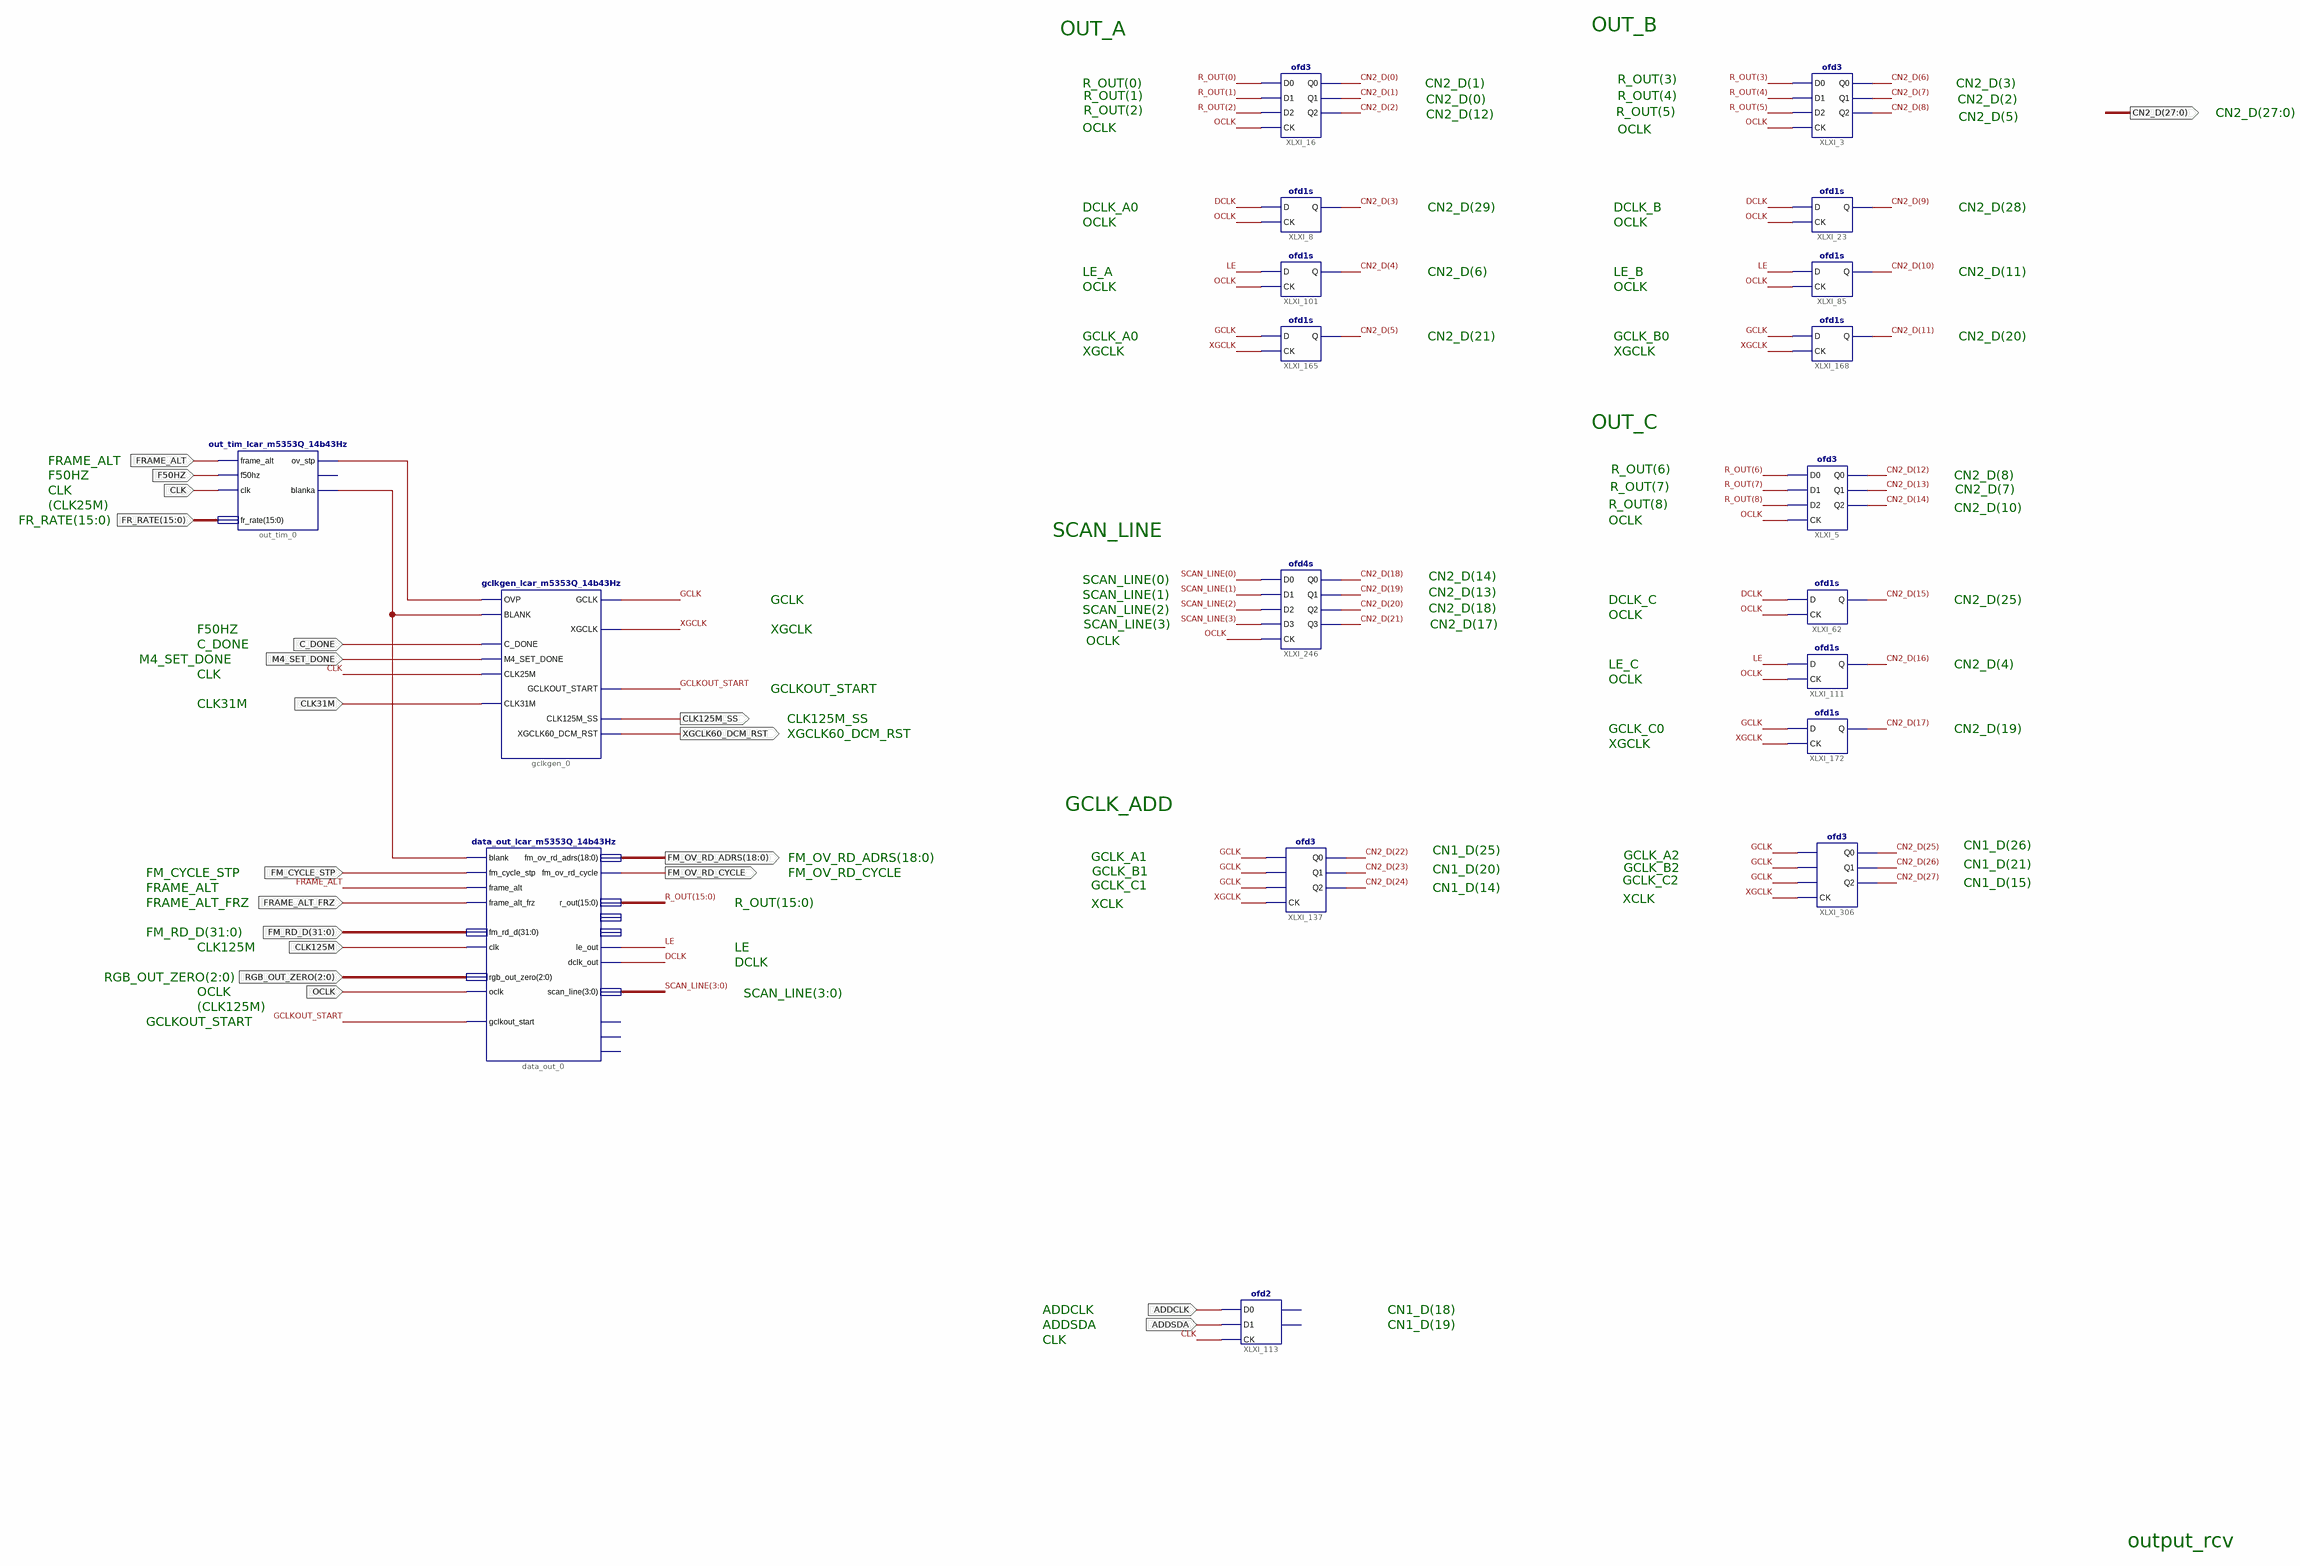
[diagram p0: schematic sheet 1]
// Xilinx ISE schematic output_rcv_lcar_m5353Q_14b43Hz.sch (aspartan6) as structural Verilog: 19 symbols, 20 ports
module output_rcv_lcar_m5353Q_14b43Hz (
  input  CLK,
  input  ADDCLK,
  input  ADDSDA,
  input  FRAME_ALT,
  input  F50HZ,
  input  C_DONE,
  input  M4_SET_DONE,
  input  CLK125M,
  input  FM_CYCLE_STP,
  input  [31:0] FM_RD_D,
  input  [2:0] RGB_OUT_ZERO,
  input  OCLK,
  input  [15:0] FR_RATE,
  input  FRAME_ALT_FRZ,
  input  CLK31M,
  output [27:0] CN2_D,
  output [18:0] FM_OV_RD_ADRS,
  output FM_OV_RD_CYCLE,
  output CLK125M_SS,
  output XGCLK60_DCM_RST
);

  wire DCLK, GCLK, GCLKOUT_START, LE, XGCLK, XLXN_6, XLXN_10;
  wire [3:0] SCAN_LINE;
  wire [15:0] R_OUT;

  ofd2 XLXI_113 (.D0(ADDCLK), .D1(ADDSDA), .CK(CLK));  // open: Q0, Q1
  ofd4s XLXI_246 (
    .D0(SCAN_LINE[0]), .CK(OCLK), .D1(SCAN_LINE[1]), .D2(SCAN_LINE[2]), .D3(SCAN_LINE[3]), .Q0(CN2_D[18]),
    .Q1(CN2_D[19]), .Q2(CN2_D[20]), .Q3(CN2_D[21]));
  ofd3 XLXI_5 (.D0(R_OUT[6]), .D1(R_OUT[7]), .D2(R_OUT[8]), .CK(OCLK), .Q0(CN2_D[12]), .Q1(CN2_D[13]), .Q2(CN2_D[14]));
  ofd1s XLXI_62 (.D(DCLK), .CK(OCLK), .Q(CN2_D[15]));
  ofd1s XLXI_111 (.D(LE), .CK(OCLK), .Q(CN2_D[16]));
  ofd1s XLXI_172 (.D(GCLK), .CK(XGCLK), .Q(CN2_D[17]));
  ofd1s XLXI_85 (.D(LE), .CK(OCLK), .Q(CN2_D[10]));
  ofd1s XLXI_168 (.D(GCLK), .CK(XGCLK), .Q(CN2_D[11]));
  ofd1s XLXI_23 (.D(DCLK), .CK(OCLK), .Q(CN2_D[9]));
  ofd3 XLXI_3 (.D0(R_OUT[3]), .D1(R_OUT[4]), .D2(R_OUT[5]), .CK(OCLK), .Q0(CN2_D[6]), .Q1(CN2_D[7]), .Q2(CN2_D[8]));
  ofd3 XLXI_16 (.D0(R_OUT[0]), .D1(R_OUT[1]), .D2(R_OUT[2]), .CK(OCLK), .Q0(CN2_D[0]), .Q1(CN2_D[1]), .Q2(CN2_D[2]));
  ofd1s XLXI_101 (.D(LE), .CK(OCLK), .Q(CN2_D[4]));
  ofd1s XLXI_165 (.D(GCLK), .CK(XGCLK), .Q(CN2_D[5]));
  ofd1s XLXI_8 (.D(DCLK), .CK(OCLK), .Q(CN2_D[3]));
  ofd3 XLXI_137 (.D0(GCLK), .D1(GCLK), .D2(GCLK), .CK(XGCLK), .Q0(CN2_D[22]), .Q1(CN2_D[23]), .Q2(CN2_D[24]));
  ofd3 XLXI_306 (.D0(GCLK), .D1(GCLK), .D2(GCLK), .CK(XGCLK), .Q0(CN2_D[25]), .Q1(CN2_D[26]), .Q2(CN2_D[27]));
  data_out_lcar_m5353Q_14b43Hz data_out_0 (
    .fm_cycle_stp(FM_CYCLE_STP), .frame_alt_frz(FRAME_ALT_FRZ), .frame_alt(FRAME_ALT), .clk(CLK125M),
    .oclk(OCLK), .blank(XLXN_10), .gclkout_start(GCLKOUT_START), .fm_rd_d(FM_RD_D),
    .rgb_out_zero(RGB_OUT_ZERO), .fm_ov_rd_cycle(FM_OV_RD_CYCLE), .le_out(LE), .dclk_out(DCLK),
    .fm_ov_rd_adrs(FM_OV_RD_ADRS), .scan_line(SCAN_LINE), .r_out(R_OUT));  // open: r_we, g_we, b_we, g_out, b_out
  out_tim_lcar_m5353Q_14b43Hz out_tim_0 (
    .clk(CLK), .f50hz(F50HZ), .frame_alt(FRAME_ALT), .fr_rate(FR_RATE), .blanka(XLXN_10), .ov_stp(XLXN_6));  // open: ovt
  gclkgen_lcar_m5353Q_14b43Hz gclkgen_0 (
    .C_DONE(C_DONE), .OVP(XLXN_6), .CLK25M(CLK), .CLK31M(CLK31M), .BLANK(XLXN_10), .M4_SET_DONE(M4_SET_DONE),
    .XGCLK60_DCM_RST(XGCLK60_DCM_RST), .XGCLK(XGCLK), .GCLK(GCLK), .GCLKOUT_START(GCLKOUT_START),
    .CLK125M_SS(CLK125M_SS));

  // Notes on the sheet:
  //   OUT_B
  //   OUT_A
  //   R_OUT(3)
  //   R_OUT(0)
  //   CN2_D(1)
  //   CN2_D(3)
  //   R_OUT(1)
  //   R_OUT(4)
  //   CN2_D(0)
  //   CN2_D(2)
  //   R_OUT(2)
  //   R_OUT(5)
  //   CN2_D(27:0)
  //   CN2_D(12)
  //   CN2_D(5)
  //   OCLK
  //   OCLK
  //   DCLK_A0
  //   CN2_D(29)
  //   DCLK_B
  //   CN2_D(28)
  //   OCLK
  //   OCLK
  //   LE_A
  //   CN2_D(6)
  //   LE_B
  //   CN2_D(11)
  //   OCLK
  //   OCLK
  //   GCLK_A0
  //   CN2_D(21)
  //   GCLK_B0
  //   CN2_D(20)
  //   XGCLK
  //   XGCLK
  //   OUT_C
  //   FRAME_ALT
  //   R_OUT(6)
  //   F50HZ
  //   CN2_D(8)
  //   R_OUT(7)
  //   CN2_D(7)
  //   CLK
  //   R_OUT(8)
  //   (CLK25M)
  //   CN2_D(10)
  //   FR_RATE(15:0)
  //   OCLK
  //   SCAN_LINE
  //   CN2_D(14)
  //   SCAN_LINE(0)
  //   CN2_D(13)
  //   SCAN_LINE(1)
  //   GCLK
  //   DCLK_C
  //   CN2_D(25)
  //   CN2_D(18)
  //   SCAN_LINE(2)
  //   OCLK
  //   SCAN_LINE(3)
  //   CN2_D(17)
  //   F50HZ
  //   XGCLK
  //   OCLK
  //   C_DONE
  //   M4_SET_DONE
  //   LE_C
  //   CN2_D(4)
  //   CLK
  //   OCLK
  //   GCLKOUT_START
  //   CLK31M
  //   CLK125M_SS
  //   GCLK_C0
  //   CN2_D(19)
  //   XGCLK60_DCM_RST
  //   XGCLK
  //   GCLK_ADD
  //   CN1_D(26)
  //   CN1_D(25)
  //   GCLK_A2
  //   GCLK_A1
  //   FM_OV_RD_ADRS(18:0)
  //   CN1_D(21)
  //   GCLK_B2
  //   CN1_D(20)
  //   GCLK_B1
  //   FM_CYCLE_STP
  //   FM_OV_RD_CYCLE
  //   GCLK_C2
  //   CN1_D(15)
  //   GCLK_C1
  //   FRAME_ALT
  //   CN1_D(14)
  //   XCLK
  //   FRAME_ALT_FRZ
  //   R_OUT(15:0)
  //   XCLK
  //   FM_RD_D(31:0)
  //   CLK125M
  //   LE
  //   DCLK
  //   RGB_OUT_ZERO(2:0)
  //   OCLK
  //   SCAN_LINE(3:0)
  //   (CLK125M)
  //   GCLKOUT_START
  //   ADDCLK
  //   CN1_D(18)
  //   ADDSDA
  //   CN1_D(19)
  //   CLK
  //   output_rcv
endmodule
